# EAGLE schematic RgbLedPanel (EAGLE 7.2.0)
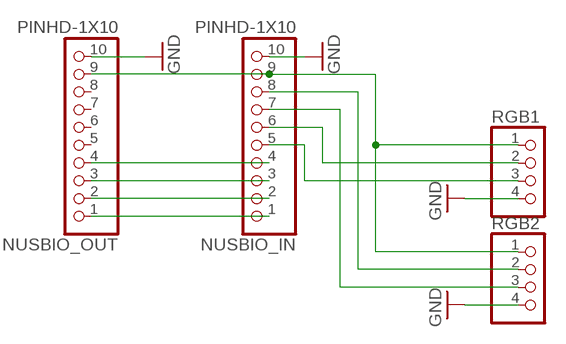
[diagram p0: schematic, sheet 1]

## Parts
NUSBIO_IN  PINHD-1X10  [1X10-BIG]
NUSBIO_OUT  PINHD-1X10  [1X10-BIG]
RGB1  PINHD-1X4  [1X04]
RGB2  PINHD-1X4  [1X04]

## Nets
GND: NUSBIO_IN.10 NUSBIO_OUT.10 RGB1.4 RGB2.4
N$1: NUSBIO_IN.9 NUSBIO_OUT.9 RGB1.1 RGB2.1
N$2: NUSBIO_IN.5 RGB1.3
N$3: NUSBIO_IN.1 NUSBIO_OUT.1
N$4: NUSBIO_IN.8 RGB2.2
N$5: NUSBIO_IN.7 RGB2.3
N$6: NUSBIO_IN.6 RGB1.2
N$7: NUSBIO_IN.2 NUSBIO_OUT.2
N$8: NUSBIO_IN.3 NUSBIO_OUT.3
N$9: NUSBIO_IN.4 NUSBIO_OUT.4
Unconnected: NUSBIO_OUT.5 NUSBIO_OUT.6 NUSBIO_OUT.7 NUSBIO_OUT.8

## Library data of the parts
NUSBIO_IN NUSBIO_OUT = adafruit:PINHD-1X10: Pin header 1x10 0.1" spacing With round pins
RGB1 RGB2 = pinhead:PINHD-1X4: PIN HEADER